# EAGLE schematic preScale-Mb501 (EAGLE 5.07)
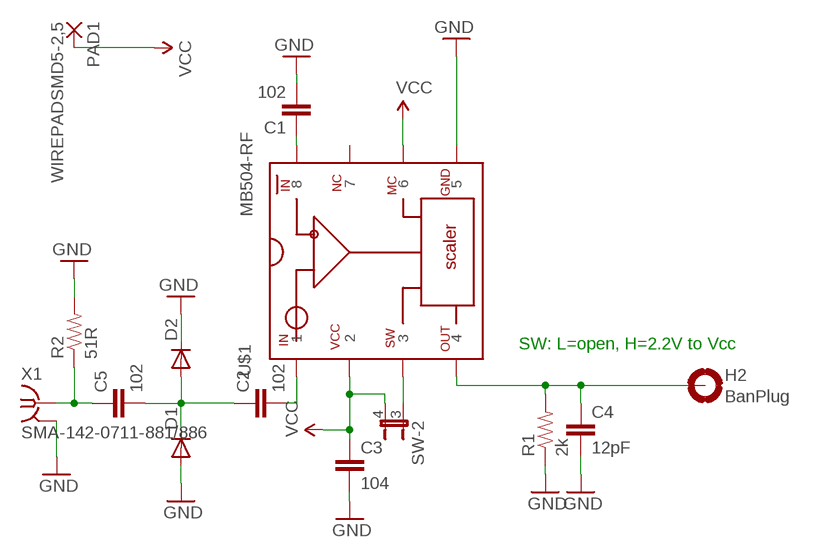
[diagram p0: schematic, sheet 1]

## Parts
C1  102  CAP-RF  [CAP-SMD-SMALL]
C2  102  CAP-C0805  [C0805]
C3  104  CAP-RF  [CAP-SMD-SMALL]
C4  12pF  CAP-C0805  [C0805]
C5  102  CAP-C0805  [C0805]
D1  DIODE1206  [1206-DIODE]
D2  DIODE1206  [1206-DIODE]
H2  BanPlug  MOUNT-PAD-ROUND5.5  [5,5-PAD]
PAD1  WIREPADSMD5-2,5  [5-2,5]
R1  2k  RESISTOR1/4W-RF  [AXIAL-0.3-SMD]
R2  51R  RESISTOR1/4W-RF  [AXIAL-0.3-SMD]
SW  JP2QE-2X2  [JP2Q]
U$1  MB504-RF  [DIP8-RF]
X1  SMA-142-0711-881/886  [J502-ND-142-0711-881/886]

## Nets
GND: C1.P$2 C3.P$2 C4.2 D1.A D2.K(C) R1.P$1 R2.P$2 U$1.P$5 X1.G@1(GND)
N$1: C1.P$1 U$1.P$8
N$2: C2.2 U$1.P$1
N$3: C2.1 C5.2 D1.K(C) D2.A
N$4: C4.1 H2.B5,5(MOUNT) R1.P$2 U$1.P$4
N$5: C5.1 R2.P$1 X1.1
N$7: SW.3 U$1.P$3
VCC: C3.P$1 PAD1.1(P) SW.4 U$1.P$2 U$1.P$6
Unconnected: SW.1 SW.2 U$1.P$7

## Notes on the sheet
- SW: L=open, H=2.2V to Vcc

## Power pins joined to a net without a drawn wire
GND: X1.G@2(GND) X1.G@3(GND) X1.G@4(GND)

## Library data of the parts
C1-C5 = digital-toy:CAP: Capacitor Standard 0603 ceramic capacitor, and 0.1" leaded capacitor.
D1 D2 = digital-toy:DIODE: Diode These are standard reverse protection diodes and small signal diodes. SMA package can handle up to about 1A. SOD-323 can handle about 200mA. What the SOD-323 package when ordering, there are some mfgs out there that are 5-pin packages.
H2 = holes:MOUNT-PAD-ROUND: MOUNTING PAD, round
PAD1 = wirepad:WIREPAD: Wire PAD connect wire on PCB
R1 R2 = digital-toy:RESISTOR: Resistor Basic schematic elements and footprints for 0603, 1206, and PTH 1/10th watt (small) resistors. digital-toy copy vertical mount of axial-0.3 from rcl.lbr : the 0207/xx
SW = digital-toy:JP2QE: JUMPER
U$1 = dtoy-RF:MB504: MB501/504 by hyl 2011.4.8
X1 = con-coax:SMA-: SMA 50 Ohm End Launch Jack Receptacle - Round Contact Johnson Components Source: www.johnsoncomponents.com .. J502-ND.pdf